# EAGLE design Stromversorgung (EAGLE 7.4.0)
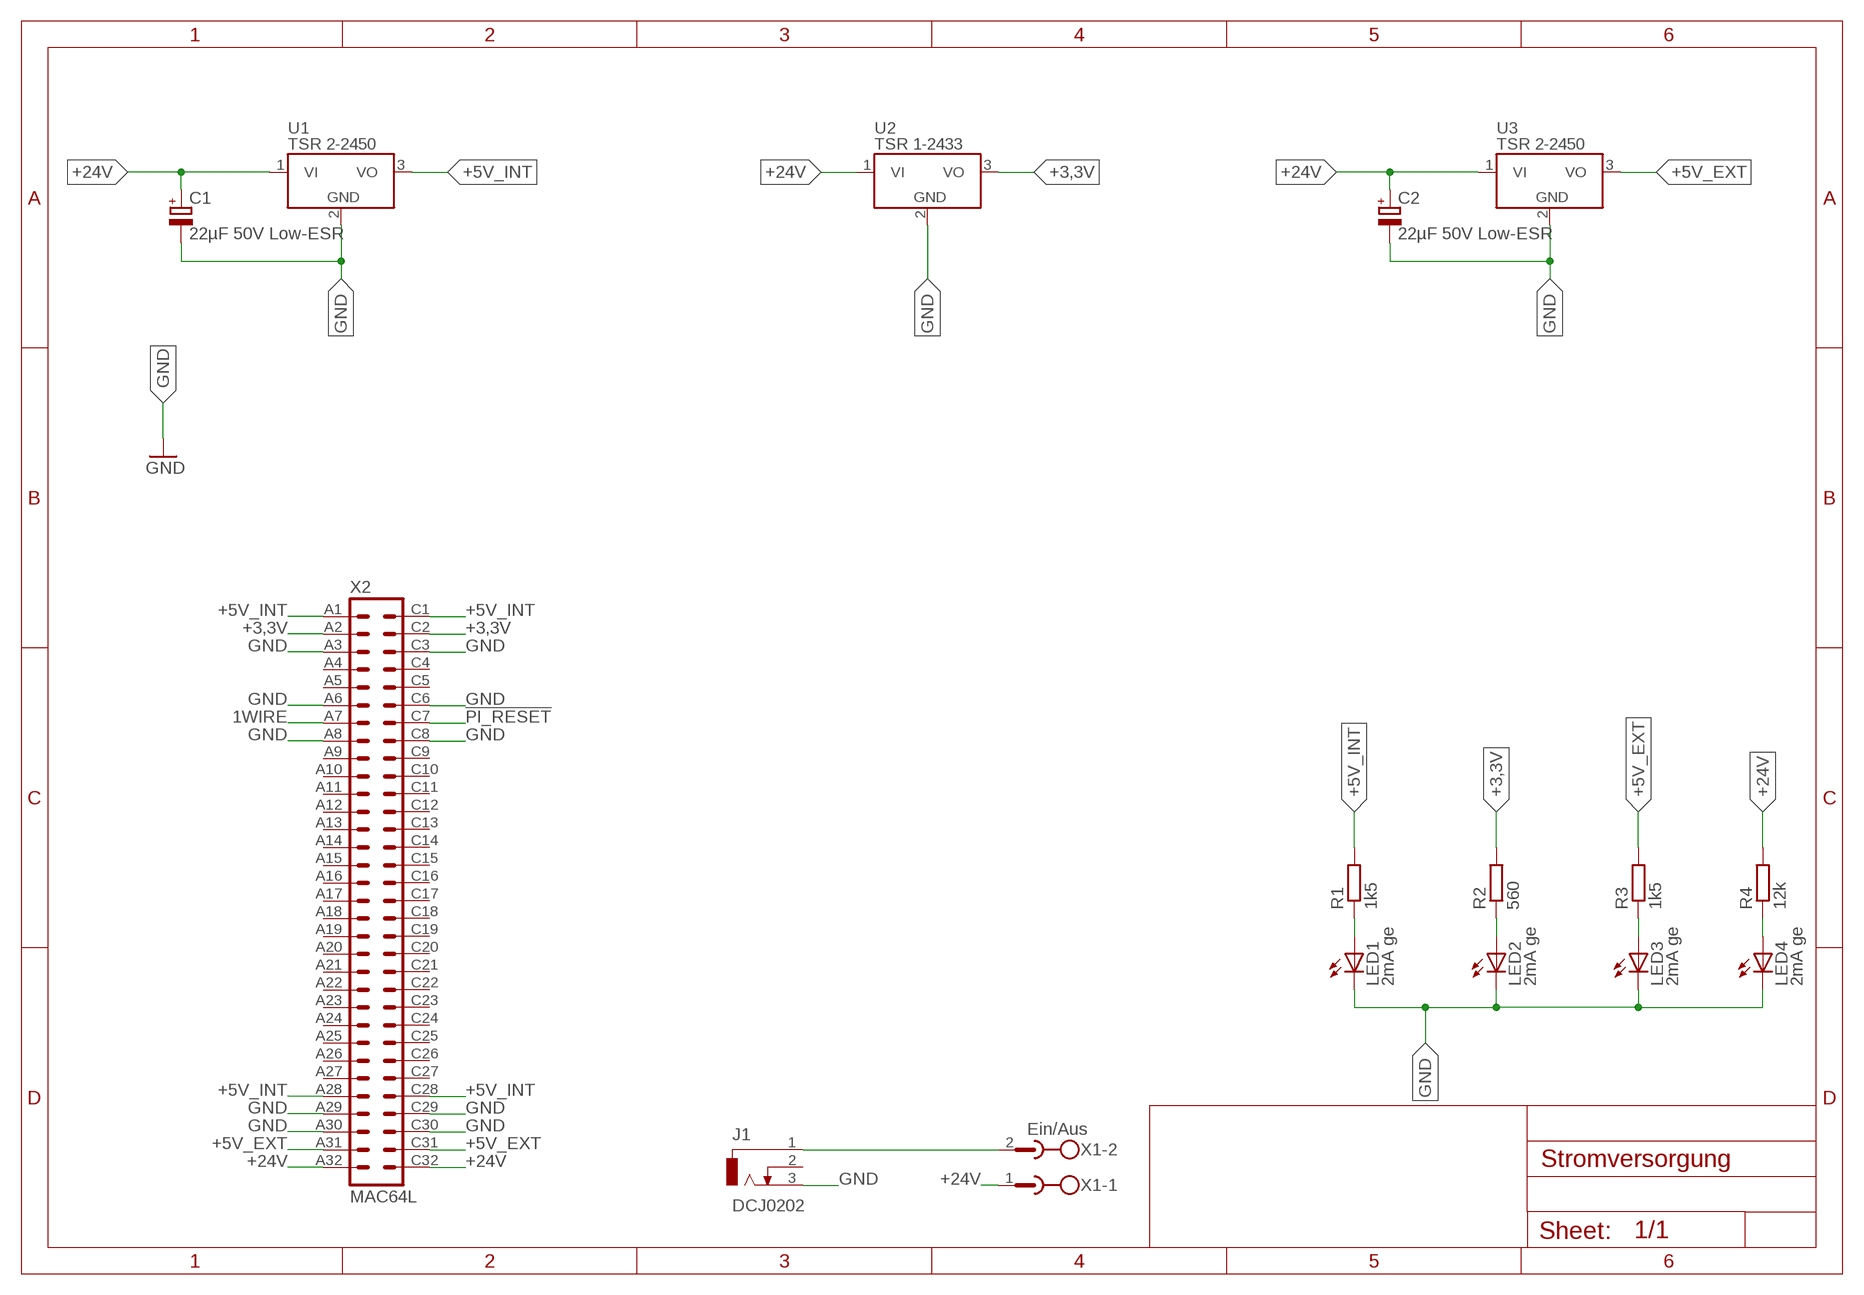
[diagram p0: schematic, sheet 1]

## Parts
C1  22µF 50V Low-ESR  CPOL-EUE2-5  [E2-5]
C2  22µF 50V Low-ESR  CPOL-EUE2-5  [E2-5]
J1  DCJ0202  [DCJ0202]
LED1  2mA ge  LED3MM  [LED3MM]
LED2  2mA ge  LED3MM  [LED3MM]
LED3  2mA ge  LED3MM  [LED3MM]
LED4  2mA ge  LED3MM  [LED3MM]
R1  1k5  R-EU_0204/5  [0204/5]
R2  560  R-EU_0204/5  [0204/5]
R3  1k5  R-EU_0204/5  [0204/5]
R4  12k  R-EU_0204/5  [0204/5]
U1  TSR 2-2450  TSR_1-2450  [TSR-1]
U2  TSR 1-2433  TSR_1-2433  [TSR-1]
U3  TSR 2-2450  TSR_1-2450  [TSR-1]
X1  Ein/Aus  MSTBV2  [MSTBV2]
X2  MAC64L  [MAC64L]

## Nets
1WIRE: X2.A7
!PI_RESET: X2.C7
+3,3V: R2.2 U2.3(VO) X2.A2 X2.C2
+5V_EXT: R3.2 U3.3(VO) X2.A31 X2.C31
+5V_INT: R1.2 U1.3(VO) X2.A1 X2.A28 X2.C1 X2.C28
+24V: C1.+ C2.+ R4.2 U1.1(VI) U2.1(VI) U3.1(VI) X1.1 X2.A32 X2.C32
GND: C1.- C2.- J1.3 LED1.K(C) LED2.K(C) LED3.K(C) LED4.K(C) U1.2(GND) U2.2(GND) U3.2(GND) X2.A3 X2.A6 X2.A8 X2.A29 X2.A30 X2.C3 X2.C6 X2.C8 X2.C29 X2.C30
N$1: J1.1 X1.2
N$3: LED4.A R4.1
N$6: LED1.A R1.1
N$7: LED2.A R2.1
N$8: LED3.A R3.1
Unconnected: J1.2 X2.A4 X2.A5 X2.A9 X2.A10 X2.A11 X2.A12 X2.A13 X2.A14 X2.A15 X2.A16 X2.A17 X2.A18 X2.A19 X2.A20 X2.A21 X2.A22 X2.A23 X2.A24 X2.A25 X2.A26 X2.A27 X2.C4 X2.C5 X2.C9 X2.C10 X2.C11 X2.C12 X2.C13 X2.C14 X2.C15 X2.C16 X2.C17 X2.C18 X2.C19 X2.C20 X2.C21 X2.C22 X2.C23 X2.C24 X2.C25 X2.C26 X2.C27

## Library data of the parts
C1 C2 = rcl:CPOL-EU: POLARIZED CAPACITOR, European symbol
J1 = con-jack:DCJ0202: DC POWER JACK Source: DCJ0202.pdf; OC_FARNELL: unknown; OC_NEWARK: unknown
LED1-LED4 = led:LED: LED OSRAM: - CHIPLED LG R971, LG N971, LY N971, LG Q971, LY Q971, LO R971, LY R971 LH N974, LH R974 LS Q976, LO Q976, LY Q976 LO Q996 - Hyper CHIPLED LW Q18S LB Q993, LB Q99A, LB R99A - SideLED LS A670, LO A670, LY A670, LG A670, LP A670 LB A673, LV A673, LT A673, LW A673 LH A674 LY A675 LS A676, LA A676, LO A676, LY A676, LW A676 LS A679, LY A679, LG A679 - Hyper Micro SIDELED® LS Y876, LA Y876, LO Y876, LY Y876 LT Y87S - SmartLED LW L88C, LW L88S LB L89C, LB L89S, LG L890 LS L89K, LO L89K, LY L89K LS L896, LA L896, LO L896, LY L896 - TOPLED LS T670, LO T670, LY T670, LG T670, LP T670 LSG T670, LSP T670, LSY T670, LOP T670, LYG T670 LG T671, LOG T671, LSG T671 LB T673, LV T673, LT T673, LW T673 LH T674 LS T676, LA T676, LO T676, LY T676, LB T676, LH T676, LSB T676, LW T676 LB T67C, LV T67C, LT T67C, LS T67K, LO T67K, LY T67K, LW E67C LS E67B, LA E67B, LO E67B, LY E67B, LB E67C, LV E67C, LT E67C LW T67C LS T679, LY T679, LG T679 LS T770, LO T770, LY T770, LG T770, LP T770 LB T773, LV T773, LT T773, LW T773 LH T774 LS E675, LA E675, LY E675, LS T675 LS T776, LA T776, LO T776, LY T776, LB T776 LHGB T686 LT T68C, LB T68C - Hyper Mini TOPLED® LB M676 - Mini TOPLED Santana® LG M470 LS M47K, LO M47K, LY M47K Source: http://www.osram.convergy.de LUXEON: - LUMILED® LXK2-PW12-R00, LXK2-PW12-S00, LXK2-PW14-U00, LXK2-PW14-V00 LXK2-PM12-R00, LXK2-PM12-S00, LXK2-PM14-U00 LXK2-PE12-Q00, LXK2-PE12-R00, LXK2-PE12-S00, LXK2-PE14-T00, LXK2-PE14-U00 LXK2-PB12-K00, LXK2-PB12-L00, LXK2-PB12-M00, LXK2-PB14-N00, LXK2-PB14-P00, LXK2-PB14-Q00 LXK2-PR12-L00, LXK2-PR12-M00, LXK2-PR14-Q00, LXK2-PR14-R00 LXK2-PD12-Q00, LXK2-PD12-R00, LXK2-PD12-S00 LXK2-PH12-R00, LXK2-PH12-S00 LXK2-PL12-P00, LXK2-PL12-Q00, LXK2-PL12-R00 Source: www.luxeon.com KINGBRIGHT: KA-3528ASYC Source: www.kingbright.com
R1-R4 = rcl:R-EU_: RESISTOR, European symbol
U1-U3 = _traco_tsr-1:TSR_1-*: TRACO TSR-1 Series Point-of-Load DC/DC-Converters Vi max. 36 V; Vo = (1.2 .. 15)V ±2%; Io = 0 .. 1 A SIP-Package (drop-in replacement for 78xx linear voltage regulators in TO220-package, vertically assembled) Source: www.tracopower.com Technologies: TSR 1- Vi (V) Vo (V) ±2% Io = 0 .. 1 A 24_ ( generic ) 2412 4.6 .. 36 1.2 2415 4.6 .. 36 1.5 2418 4.6 .. 36 1.8 2425 4.6 .. 36 2.5 2433 4.75.. 36 3.3 2450 6.5 .. 36 5.0 2465 9.0 .. 36 6.5 2490 12 .. 36 9.0 24120 15 .. 36 12 24150 18 .. 36 15 Author: Dipl.-Ing. FH Rainer Bayer HHN Hochschule Heilbronn, rainer.bayer@hs-heilbronn.de Ingenieurbüro ing-rb, mail@ing-rb.de
X1 = con-phoenix-508:MSTBV2: PHOENIX; MPN: MSTBV 2,5/2-GF-5.08; OC_FARNELL: 1792792; OC_NEWARK: 69R9845
X2 = con-vg:MAC64L: CONNECTOR male, 64 pins, block, type C, rows AC, grid 5.08 mm

## Board
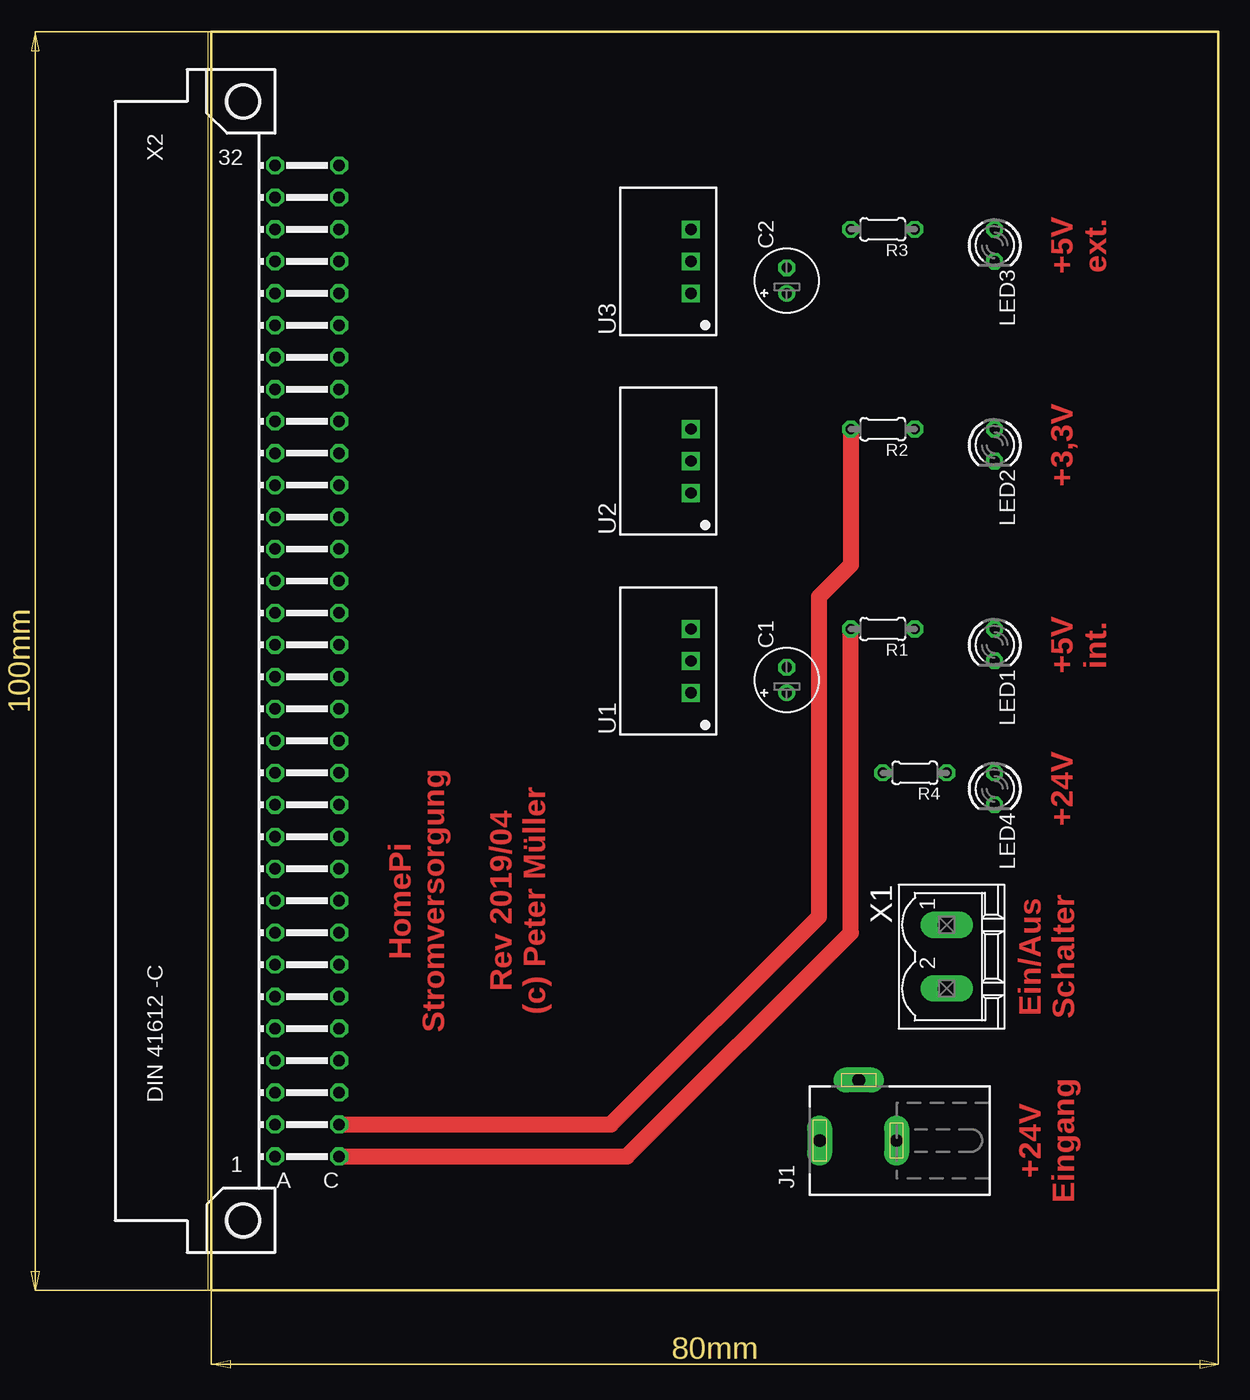
[diagram p1: board, top side]
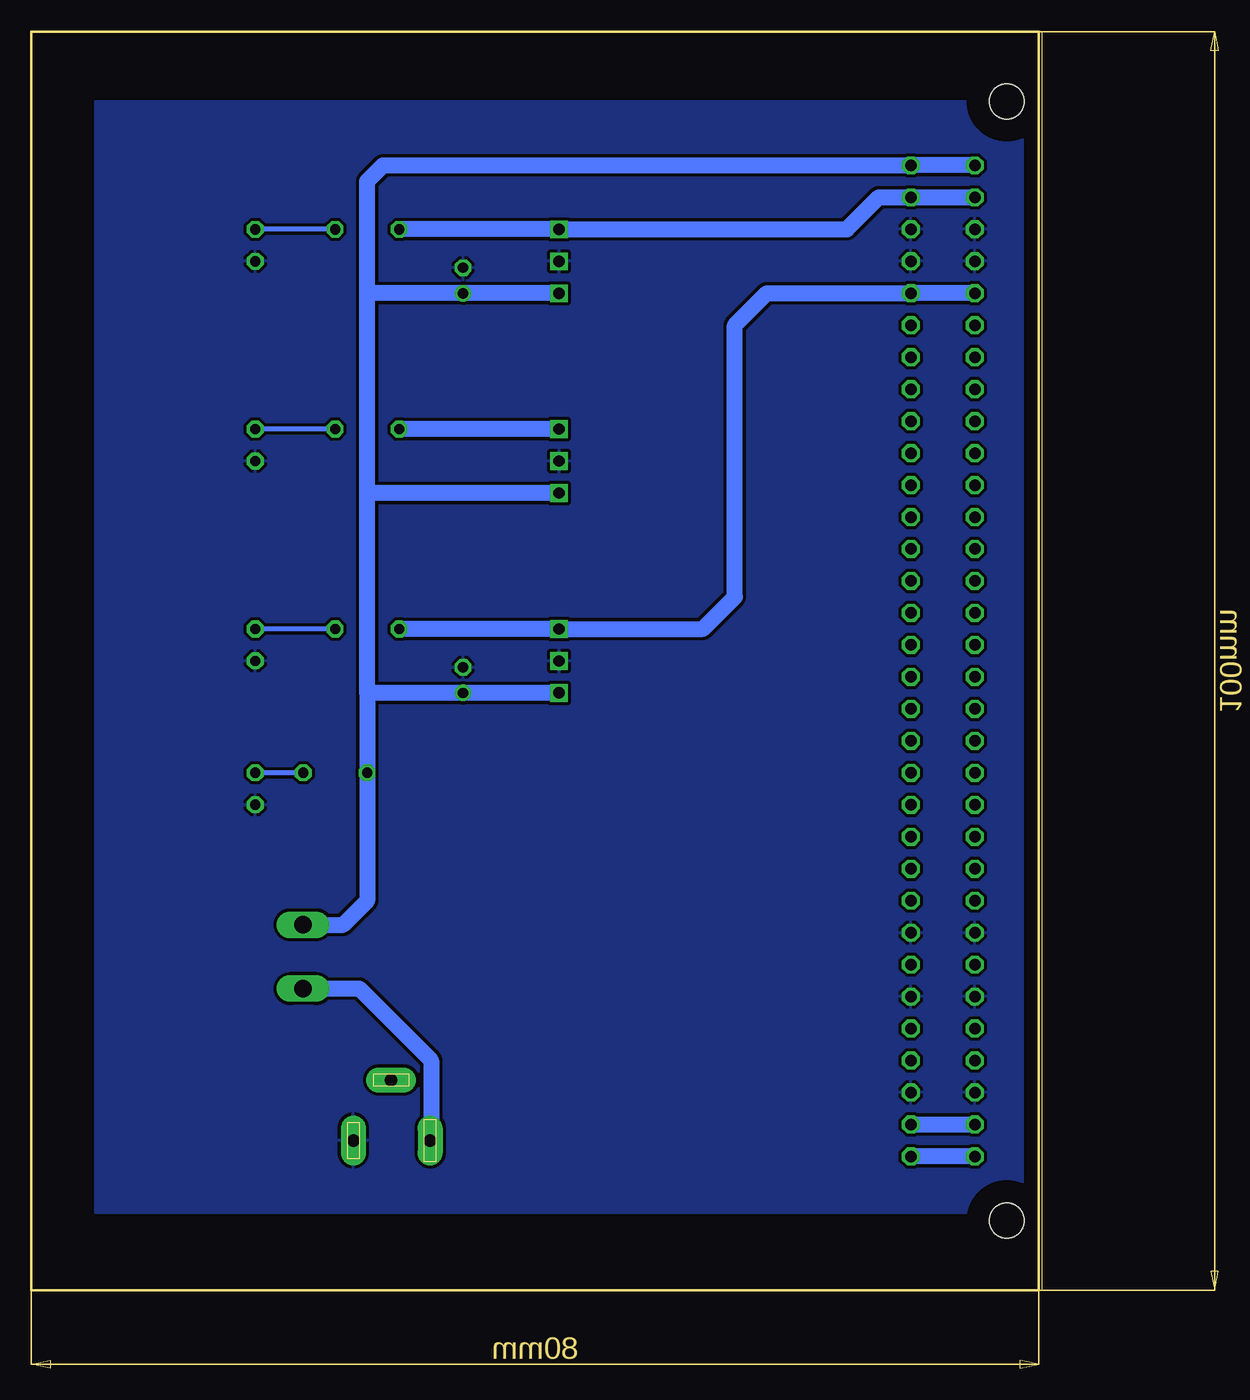
[diagram p2: board, bottom side, seen from below]

Size 80 x 100 mm. Coordinates in mm from the lower left corner, seen from the top.
Outline: 0,0 80,0 80,100 0,100 0,0
Copper layers (1*16): Top 0.035mm / dielectric 1.5mm / Bottom 0.035mm
Design rules "platinenbelichter": minimum track width 10mil, minimum drill 24mil, track to track 10mil, track to pad 10mil, pad to pad 10mil, via to via 10mil, smd to smd 10mil, copper to edge 40mil, drill to drill 8mil, minimum pad ring 10mil, minimum via ring 8mil, stop-mask expansion 10mil, vias tented up to drill 0mil, thermal gap 10mil

### Footprints (pad centres in the part's own frame; a part is rotated, then mirrored left to right if it is on the bottom)
E2-5 = drill 0.813 pad 1.27: + -1.016,0 | drill 0.813 pad 1.27 octagon: - 1.016,0
DCJ0202 = drill 1 pad 2 long: 1 0,3.1; 2 4.8,0; 3 0,-3
LED3MM = drill 0.813 octagon: A -1.27,0; K 1.27,0
0204/5 = drill 0.813 octagon: 1 -2.54,0; 2 2.54,0
TSR-1 = drill 0.9 square: 1 -2.54,0; 2 0,0; 3 2.54,0
MSTBV2 = drill 1.397 long: 1 -2.54,0; 2 2.54,0
MAC64L = drill 0.914 octagon: A1 -2.54,39.37; A2 -2.54,36.83; A3 -2.54,34.29; A4 -2.54,31.75; A5 -2.54,29.21; A6 -2.54,26.67; A7 -2.54,24.13; A8 -2.54,21.59; A9 -2.54,19.05; A10 -2.54,16.51; A11 -2.54,13.97; A12 -2.54,11.43; A13 -2.54,8.89; A14 -2.54,6.35; A15 -2.54,3.81; A16 -2.54,1.27; A17 -2.54,-1.27; A18 -2.54,-3.81; A19 -2.54,-6.35; A20 -2.54,-8.89; A21 -2.54,-11.43; A22 -2.54,-13.97; A23 -2.54,-16.51; A24 -2.54,-19.05; A25 -2.54,-21.59; A26 -2.54,-24.13; A27 -2.54,-26.67; A28 -2.54,-29.21; A29 -2.54,-31.75; A30 -2.54,-34.29; A31 -2.54,-36.83; A32 -2.54,-39.37; C1 -7.62,39.37; C2 -7.62,36.83; C3 -7.62,34.29; C4 -7.62,31.75; C5 -7.62,29.21; C6 -7.62,26.67; C7 -7.62,24.13; C8 -7.62,21.59; C9 -7.62,19.05; C10 -7.62,16.51; C11 -7.62,13.97; C12 -7.62,11.43; C13 -7.62,8.89; C14 -7.62,6.35; C15 -7.62,3.81; C16 -7.62,1.27; C17 -7.62,-1.27; C18 -7.62,-3.81; C19 -7.62,-6.35; C20 -7.62,-8.89; C21 -7.62,-11.43; C22 -7.62,-13.97; C23 -7.62,-16.51; C24 -7.62,-19.05; C25 -7.62,-21.59; C26 -7.62,-24.13; C27 -7.62,-26.67; C28 -7.62,-29.21; C29 -7.62,-31.75; C30 -7.62,-34.29; C31 -7.62,-36.83; C32 -7.62,-39.37 | hole 2.794: 0,44.45; 0,-44.45

### Placement (x,y rotation side)
C1  45.72,48.48 90 top
C2  45.72,80.22 90 top
J1  51.44,11.9 90 top
LED1  62.23,51.27 270 top
LED2  62.23,67.14 270 top
LED3  62.23,83.02 270 top
LED4  62.23,39.84 270 top
R1  53.34,52.54 180 top
R2  53.34,68.41 180 top
R3  53.34,84.29 180 top
R4  55.88,41.11 180 top
U1  38.1,50 90 top
U2  38.1,65.88 90 top
U3  38.1,81.75 90 top
X1  58.42,26.5 270 top
X2  2.54,50 180 top

### Tracks (layer width: path | path; a pad name or v marks a point on that pad's centre or on a via)
+3,3V
  Top 1.27: R2.2 50.8,57.62 48.26,55.08 48.26,29.68 31.75,13.17 X2.C2
  Bottom 1.27: X2.C2 X2.A2 | U2.3 R2.2
+5V_EXT
  Bottom 1.27: X2.A31 X2.C31 12.7,86.83 15.24,84.29 U3.3 R3.2
+5V_INT
  Top 1.27: R1.2 50.8,28.41 33.02,10.63 X2.C1
  Bottom 1.27: R1.2 U1.3 26.67,52.54 24.13,55.08 24.13,76.67 21.59,79.21 X2.C28 X2.A28 | X2.A1 X2.C1
+24V
  Bottom 0.813: C2.+ | C1.+
  Bottom 1.27: 53.34,47.46 53.34,63.34 | 53.34,63.34 53.34,79.21 | X1.1 55.24,29.04 53.34,30.95 R4.2 53.34,47.46 | U3.1 C2.+ | C2.+ 53.34,79.21 | U1.1 C1.+ | C1.+ 53.34,47.46 | X2.A32 X2.C32 52.07,89.37 53.34,88.1 53.34,79.21 | U2.1 53.34,63.34
GND
  pour Bottom: 1.27,94.45 74.93,94.45 74.93,6.18 1.27,6.18
N$1
  Bottom 1.27: X1.2 53.98,23.96 48.26,18.25 48.26,11.98 J1.1
N$3
  Bottom 0.406: R4.1 LED4.A
N$6
  Bottom 0.406: R1.1 LED1.A
N$7
  Bottom 0.406: R2.1 LED2.A
N$8
  Bottom 0.406: R3.1 LED3.A

### Text on the board
Top: +5V / ext. | +3,3V | +5V / int. | +24V | HomePi / Stromversorgung / / Rev 2019/04 / (c) Peter Müller | Ein/Aus / Schalter | +24V / Eingang